# EAGLE design EncoderPCB_V2_lower (EAGLE 9.5.2)
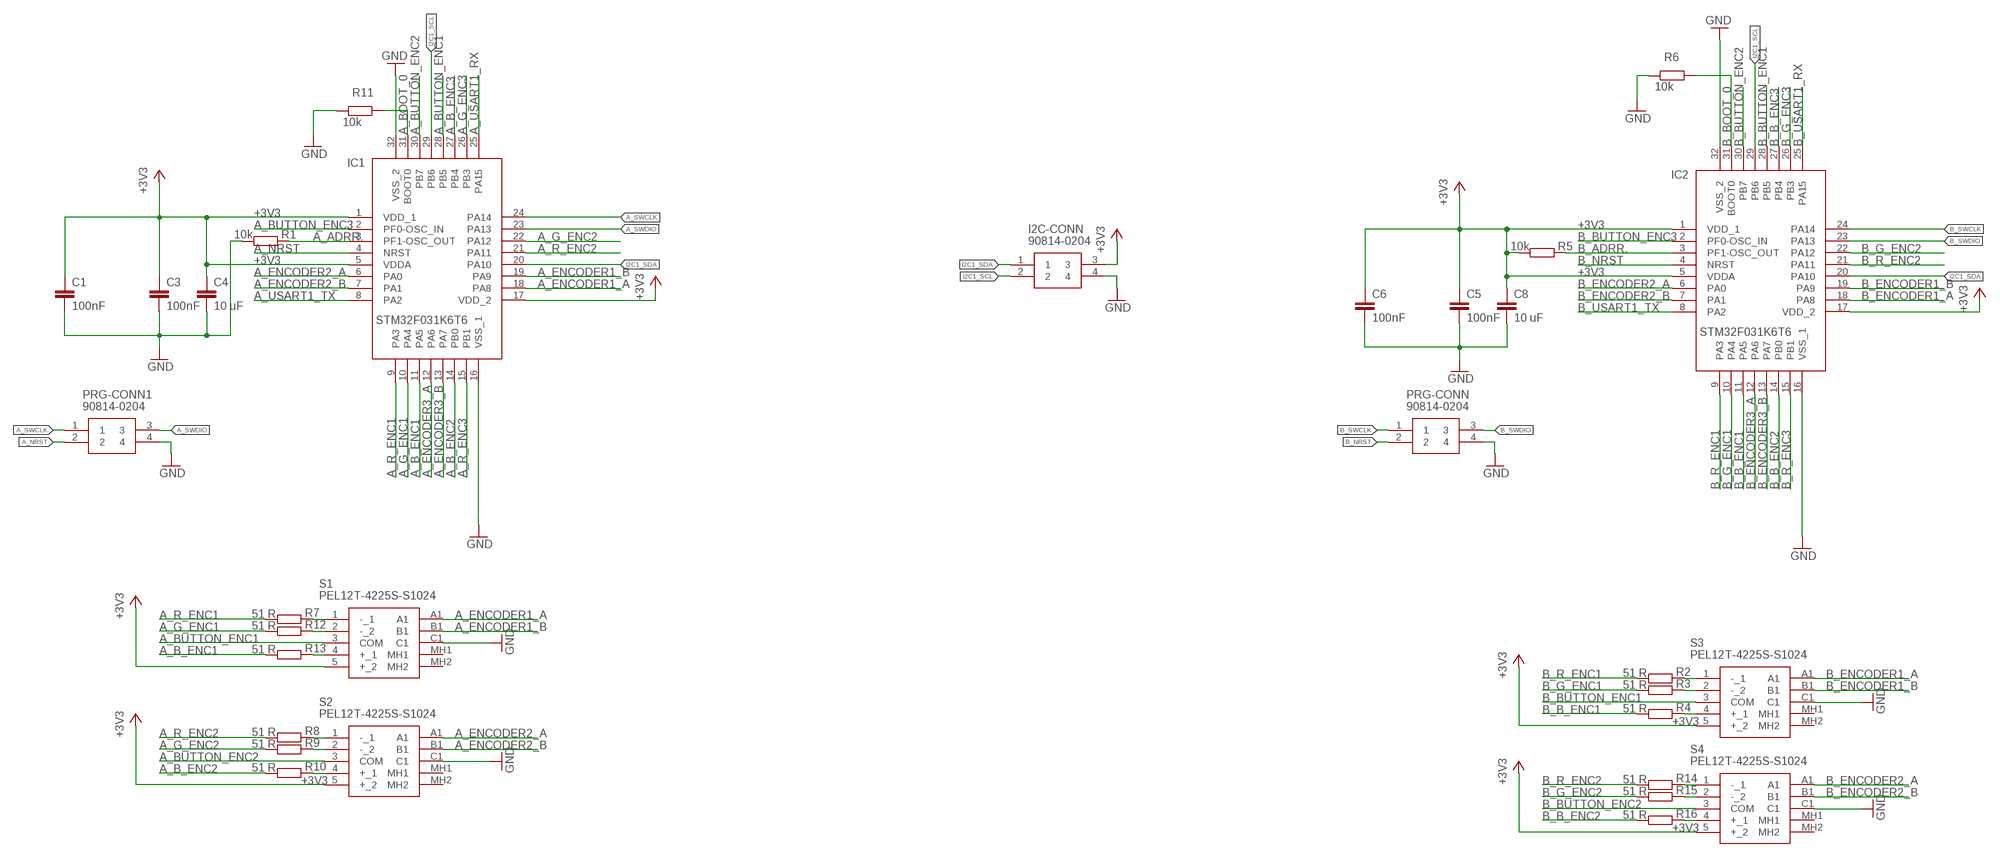
[diagram p0: schematic, sheet 1]

## Parts
C1  100nF  CAPACITOR"  [C0603]
C3  100nF  CAPACITOR"  [C0603]
C4  10 uF  CAPACITOR_1206  [C1206]
C5  100nF  CAPACITOR"  [C0603]
C6  100nF  CAPACITOR"  [C0603]
C8  10 uF  CAPACITOR_1206  [C1206]
I2C-CONN  90814-0204  [MOLEX_90814-0204]
IC1  STM32F031K6T6  [QFP80P900X900X160-32N]
IC2  STM32F031K6T6  [QFP80P900X900X160-32N]
PRG-CONN  90814-0204  [MOLEX_90814-0204]
PRG-CONN1  90814-0204  [MOLEX_90814-0204]
R1  10k  RESISTOR_0603  [R0603]
R2  51 R  RESISTOR_0603  [R0603]
R3  51 R  RESISTOR_0603  [R0603]
R4  51 R  RESISTOR_0603  [R0603]
R5  10k  RESISTOR_0603  [R0603]
R6  10k  RESISTOR_0603  [R0603]
R7  51 R  RESISTOR_0603  [R0603]
R8  51 R  RESISTOR_0603  [R0603]
R9  51 R  RESISTOR_0603  [R0603]
R10  51 R  RESISTOR_0603  [R0603]
R11  10k  RESISTOR_0603  [R0603]
R12  51 R  RESISTOR_0603  [R0603]
R13  51 R  RESISTOR_0603  [R0603]
R14  51 R  RESISTOR_0603  [R0603]
R15  51 R  RESISTOR_0603  [R0603]
R16  51 R  RESISTOR_0603  [R0603]
S1  PEL12T-4225S-S1024  [PEL12T4225SS1024]
S2  PEL12T-4225S-S1024  [PEL12T4225SS1024]
S3  PEL12T-4225S-S1024  [PEL12T4225SS1024]
S4  PEL12T-4225S-S1024  [PEL12T4225SS1024]

## Nets
+3V3: C1.1 C3.1 C4.1 C5.1 C6.1 C8.1 I2C-CONN.3 IC1.1(VDD_1) IC1.5(VDDA) IC1.17(VDD_2) IC2.1(VDD_1) IC2.5(VDDA) IC2.17(VDD_2) R5.1 S1.5(+_2) S2.5(+_2) S3.5(+_2) S4.5(+_2)
A_ADRR.: IC1.3(PF1-OSC_OUT) R1.2
A_B_ENC1: IC1.11(PA5) R13.1
A_B_ENC2: IC1.14(PB0) R10.1
A_B_ENC3: IC1.27(PB4)
A_BOOT_0: IC1.31(BOOT0) R11.2
A_BUTTON_ENC1: IC1.28(PB5) S1.3(COM)
A_BUTTON_ENC2: IC1.30(PB7) S2.3(COM)
A_BUTTON_ENC3: IC1.2(PF0-OSC_IN)
A_ENCODER1_A: IC1.18(PA8) S1.A1
A_ENCODER1_B: IC1.19(PA9) S1.B1
A_ENCODER2_A: IC1.6(PA0) S2.A1
A_ENCODER2_B: IC1.7(PA1) S2.B1
A_ENCODER3_A: IC1.12(PA6)
A_ENCODER3_B: IC1.13(PA7)
A_G_ENC1: IC1.10(PA4) R12.1
A_G_ENC2: IC1.22(PA12) R9.1
A_G_ENC3: IC1.26(PB3)
A_NRST: IC1.4(NRST) PRG-CONN1.2
A_R_ENC1: IC1.9(PA3) R7.1
A_R_ENC2: IC1.21(PA11) R8.1
A_R_ENC3: IC1.15(PB1)
A_SWCLK: IC1.24(PA14) PRG-CONN1.1
A_SWDIO: IC1.23(PA13) PRG-CONN1.3
A_USART1_RX: IC1.25(PA15)
A_USART1_TX: IC1.8(PA2)
B_ADRR.: IC2.3(PF1-OSC_OUT) R5.2
B_B_ENC1: IC2.11(PA5) R4.1
B_B_ENC2: IC2.14(PB0) R16.1
B_B_ENC3: IC2.27(PB4)
B_BOOT_0: IC2.31(BOOT0) R6.2
B_BUTTON_ENC1: IC2.28(PB5) S3.3(COM)
B_BUTTON_ENC2: IC2.30(PB7) S4.3(COM)
B_BUTTON_ENC3: IC2.2(PF0-OSC_IN)
B_ENCODER1_A: IC2.18(PA8) S3.A1
B_ENCODER1_B: IC2.19(PA9) S3.B1
B_ENCODER2_A: IC2.6(PA0) S4.A1
B_ENCODER2_B: IC2.7(PA1) S4.B1
B_ENCODER3_A: IC2.12(PA6)
B_ENCODER3_B: IC2.13(PA7)
B_G_ENC1: IC2.10(PA4) R3.1
B_G_ENC2: IC2.22(PA12) R15.1
B_G_ENC3: IC2.26(PB3)
B_NRST: IC2.4(NRST) PRG-CONN.2
B_R_ENC1: IC2.9(PA3) R2.1
B_R_ENC2: IC2.21(PA11) R14.1
B_R_ENC3: IC2.15(PB1)
B_SWCLK: IC2.24(PA14) PRG-CONN.1
B_SWDIO: IC2.23(PA13) PRG-CONN.3
B_USART1_RX: IC2.25(PA15)
B_USART1_TX: IC2.8(PA2)
GND: C1.2 C3.2 C4.2 C5.2 C6.2 C8.2 I2C-CONN.4 IC1.16(VSS_1) IC1.32(VSS_2) IC2.16(VSS_1) IC2.32(VSS_2) PRG-CONN1.4 PRG-CONN.4 R1.1 R6.1 R11.1 S1.C1 S2.C1 S3.C1 S4.C1
I2C1_SCL: I2C-CONN.2 IC1.29(PB6) IC2.29(PB6)
I2C1_SDA: I2C-CONN.1 IC1.20(PA10) IC2.20(PA10)
N$1: R7.2 S1.1(-_1)
N$2: R12.2 S1.2(-_2)
N$3: R13.2 S1.4(+_1)
N$4: R14.2 S4.1(-_1)
N$5: R15.2 S4.2(-_2)
N$6: R16.2 S4.4(+_1)
N$9: R2.2 S3.1(-_1)
N$10: R3.2 S3.2(-_2)
N$12: R4.2 S3.4(+_1)
N$15: R8.2 S2.1(-_1)
N$16: R9.2 S2.2(-_2)
N$17: R10.2 S2.4(+_1)
Unconnected: S1.MH1 S1.MH2 S2.MH1 S2.MH2 S3.MH1 S3.MH2 S4.MH1 S4.MH2

## Library data of the parts
C1 C3 C5 C6 = C_Sager_Bibliothek:CAPACITOR: capacitor
C4 C8 = passive components:CAPACITOR: ceramic capacitor
I2C-CONN PRG-CONN PRG-CONN1 = electro_mechanical:90814-0204: CONN HEADER 4POS 1.27MM SMD TIN Source: Datasheet <https://componentsearchengine.com/Datasheets/1/90814-0204.pdf>; DESCRIPTION: CONN HEADER 4POS 1.27MM SMD TIN; HEIGHT: mm; MANUFACTURER_NAME: Molex; MANUFACTURER_PART_NUMBER: 90814-0204; MOUSER_PART_NUMBER: 538-90814-0204; MOUSER_PRICE-STOCK: https://www.mouser.com/Search/Refine.aspx?Keyword=538-90814-0204
IC1 IC2 = C_Sager_Bibliothek:STM32F031K6T6: ARM Microcontrollers - MCU 16/32-BITS MICROS Source: Datasheet <https://componentsearchengine.com/Datasheets/1/STM32F031K6T6.pdf>; DESCRIPTION: ARM Microcontrollers - MCU 16/32-BITS MICROS; HEIGHT: 1.6mm; MANUFACTURER_NAME: STMicroelectronics; MANUFACTURER_PART_NUMBER: STM32F031K6T6; MOUSER_PART_NUMBER: 511-STM32F031K6T6; MOUSER_PRICE-STOCK: https://www.mouser.com/Search/Refine.aspx?Keyword=511-STM32F031K6T6
R1-R16 = passive components:RESISTOR: +/- 5 % resistor
S1-S4 = electro_mechanical:PEL12T-4225S-S1024: Encoders Red Blue/Green LED Push Switch Knurled Source: Datasheet <https://componentsearchengine.com/Datasheets/1/PEL12T-4225S-S1024.pdf>; DESCRIPTION: Encoders Red Blue/Green LED Push Switch Knurled; HEIGHT: 25mm; MANUFACTURER_NAME: Bourns; MANUFACTURER_PART_NUMBER: PEL12T-4225S-S1024; MOUSER_PART_NUMBER: 652-PEL12T4225SS1024; MOUSER_PRICE-STOCK: https://www.mouser.com/Search/Refine.aspx?Keyword=652-PEL12T4225SS1024

## Board
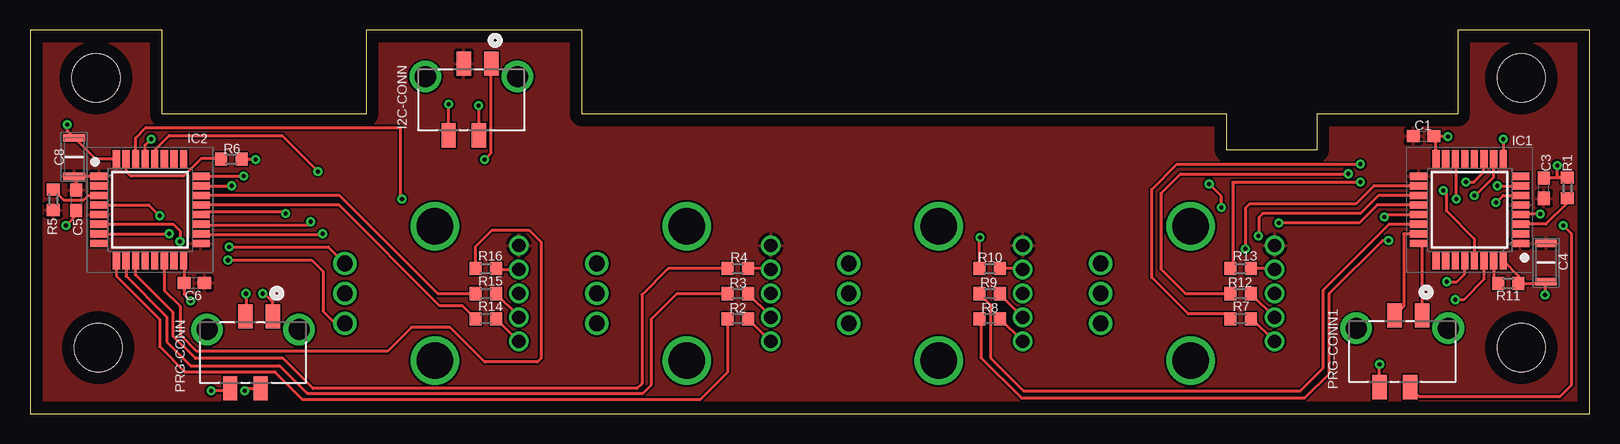
[diagram p1: board, top side]
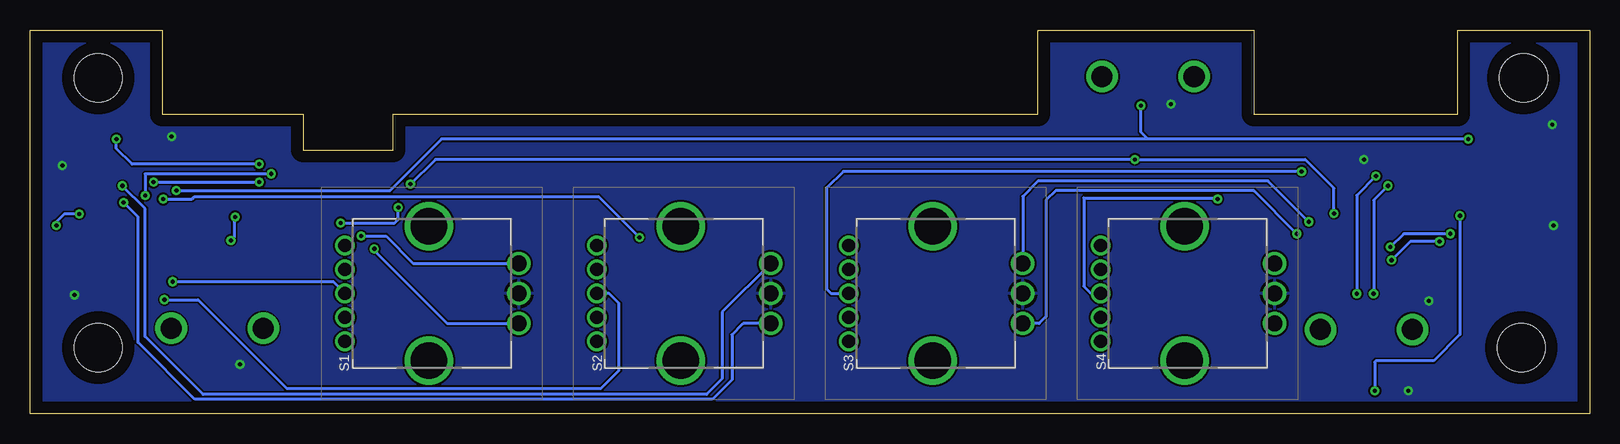
[diagram p2: board, bottom side, seen from below]

Size 130 x 32 mm. Coordinates in mm from the lower left corner, seen from the top.
Outline: 0,0 130,0 130,32 119,32 119,25 107.25,25 107.25,22 99.75,22 99.75,25 46,25 46,32 28,32 28,25 11,25 11,32 0,32 0,0
Copper layers (1*16): Top 0.035mm / dielectric 1.5mm / Bottom 0.035mm
Design rules "2layer": minimum track width 6mil, minimum drill 0.35mm, track to track 6mil, track to pad 6mil, pad to pad 6mil, via to via 6mil, smd to smd 6mil, copper to edge 40mil, drill to drill 6mil, minimum pad ring 10mil, minimum via ring 8mil, stop-mask expansion 4mil, vias tented up to drill 0mil, thermal gap 10mil
Holes 4 mm at 124.31,5.5 5.69,5.5 5.5,28 124.31,28

### Footprints (pad centres in the part's own frame; a part is rotated, then mirrored left to right if it is on the bottom)
C0603 = smd 1.1 x 1: 1 -0.85,0; 2 0.85,0
C1206 = smd 0.62 x 1.82: 1 -1.6,0; 2 1.6,0
MOLEX_90814-0204 = smd 1.194 x 2.007: 1 0.254,0; 2 1.27,5.994; 3 2.54,0; 4 3.81,5.994 | drill 1.753 pad 2.629: 5 -1.93,1.092; 6 5.74,1.092
QFP80P900X900X160-32N = smd 1.475 x 0.6: 1 -4.238,2.8; 2 -4.238,2; 3 -4.238,1.2; 4 -4.238,0.4; 5 -4.238,-0.4; 6 -4.238,-1.2; 7 -4.238,-2; 8 -4.238,-2.8; 17 4.238,-2.8; 18 4.238,-2; 19 4.238,-1.2; 20 4.238,-0.4; 21 4.238,0.4; 22 4.238,1.2; 23 4.238,2; 24 4.238,2.8 | smd 0.6 x 1.475: 9 -2.8,-4.238; 10 -2,-4.238; 11 -1.2,-4.238; 12 -0.4,-4.238; 13 0.4,-4.238; 14 1.2,-4.238; 15 2,-4.238; 16 2.8,-4.238; 25 2.8,4.238; 26 2,4.238; 27 1.2,4.238; 28 0.4,4.238; 29 -0.4,4.238; 30 -1.2,4.238; 31 -2,4.238; 32 -2.8,4.238
R0603 = smd 1 x 1.1: 1 -0.85,0; 2 0.85,0
PEL12T4225SS1024 = drill 1.1 pad 1.6: 1 -4,7.25; 2 -2,7.25; 3 0,7.25; 4 2,7.25; 5 4,7.25 | drill 1.3 pad 1.85: A1 -2.5,-7.25; B1 2.5,-7.25; C1 0,-7.25 | drill 3.041 pad 3.175: MH1 -5.6,0.25; MH2 5.6,0.25

### Placement (x,y rotation side)
C1  116.17,23.14 0 top
C3  126.19,18.8 90 top
C4  126.38,12.59 270 top
C5  3.85,17.8 270 top
C6  13.7,10.88 180 top
C8  3.68,21.41 90 top
I2C-CONN  38.7,29.2 180 top
IC1  120,17 180 top
IC2  10,17 0 top
PRG-CONN  20.5,8.1 180 top
PRG-CONN1  116.3,8.2 180 top
R1  128.15,18.83 270 top
R2  59,7.9 0 top
R3  59,10 0 top
R4  59,12.1 0 top
R5  1.94,17.84 90 top
R6  16.78,21.22 180 top
R7  100.9,7.9 0 top
R8  80,7.9 0 top
R9  80,10 0 top
R10  80,12.1 0 top
R11  123.23,10.85 180 top
R12  100.9,10 0 top
R13  100.9,12.1 0 top
R14  38,7.9 0 top
R15  38,10 0 top
R16  38,12.1 0 top
S1  96.5,10.02 90 bottom
S2  75.5,10.02 90 bottom
S3  54.5,10.02 90 bottom
S4  33.5,10.02 90 bottom

### Tracks (layer width: path | path; a pad name or v marks a point on that pad's centre or on a via)
+3V3
  Top 0.254: C5.1 3.85,19.64 C8.1 IC2.1
  pour Top: 130,32 130,0 0,0 0,32 10.9,32 10.9,25 28,25 28,32 46,32 46,25 99.7,25 99.7,22 107.3,22 107.3,25 119,25 119,32
A_ADRR.
  Top 0.254: R1.2 128.15,17.58 126.37,15.8 IC1.3
A_B_ENC1  (via drill 0.35)
  Top 0.254: R13.1 100.25,12.3 100.25,19.3 v110.9,19.3 | v119.7,19.3 120.36,19.3 121.2,20.14 IC1.11
  Bottom 0.254: v119.7,19.3 v110.9,19.3
A_B_ENC2  (via drill 0.35)
  Top 0.254: R10.1 79.15,14.65 v79.2,14.7 | v118.9,17.9 118.9,21.14 IC1.14
  Bottom 0.254: v118.9,17.9 116.5,17.9 116.3,18.1 82.6,18.1 v79.2,14.7
A_BOOT_0
  Top 0.254: IC1.31 122,11.23 R11.2
A_BUTTON_ENC1  (via drill 0.35)
  Top 0.254: v118.1,11 118.94,11 119.6,11.66 IC1.28
  Bottom 0.254: S1.3 103.75,10.05 104.7,11 v118.1,11
A_BUTTON_ENC2  (via drill 0.35)
  Top 0.254: IC1.30 121.2,11.2 119.5,9.5 v118.8,9.5
  Bottom 0.254: v118.8,9.5 116,9.5 108.61,2.11 82.39,2.11 80.9,3.6 80.9,9.2 81.72,10.02 S2.3
A_ENCODER1_A  (via drill 0.35)
  Top 0.254: IC1.18 115.74,18.98 112.01,18.98 110.53,17.5 101.66,17.5 101.3,17.14 v101.3,13.74
  Bottom 0.254: v101.3,13.74 101.26,13.74 101.26,13.56 95.21,7.52 S1.A1
A_ENCODER1_B  (via drill 0.35)
  Top 0.254: IC1.19 112.4,18.2 110.9,16.7 102.77,16.7 102.44,16.37 102.44,14.84 v102.4,14.8
  Bottom 0.254: v102.4,14.8 100.33,14.8 98.05,12.52 S1.B1
A_ENCODER2_A  (via drill 0.35)
  Top 0.254: v122.2,17.6 122.8,18.2 IC1.6
  Bottom 0.254: S2.A1 70.55,7.52 71.5,6.57 71.5,2.8 73.11,1.19 116.26,1.19 121,5.93 121,16.4 v122.2,17.6
A_ENCODER2_B  (via drill 0.35)
  Top 0.254: v122.3,19 IC1.7
  Bottom 0.254: S2.B1 72.3,8.47 72.3,2.9 73.6,1.6 115.56,1.6 120.4,6.43 120.4,17.1 v122.3,19
A_G_ENC1  (via drill 0.35)
  Top 0.254: R12.1 96.35,10 94.27,12.08 94.27,18.37 95.9,20 v109.9,20 | IC1.10 122,19.74 120.46,18.2 v120.4,18.2
  Bottom 0.254: v109.9,20 120.4,20 v120.4,18.2
A_G_ENC2
  Top 0.254: R9.1 80.07,9.08 80.07,4.63 82.81,1.9 105.9,1.9 107.8,3.8 107.8,10.3 113.3,15.8 IC1.22
A_NRST  (via drill 0.35)
  Top 0.254: PRG-CONN1.2 115.83,1.41 127.51,1.41 128.5,2.4 128.5,15 v127.8,15.7 | v125.89,16.66 124.3,16.66 IC1.4
  Bottom 0.254: v127.8,15.7 127.8,16 127.14,16.66 v125.89,16.66
A_R_ENC1  (via drill 0.35)
  Top 0.254: R7.1 99.65,8.3 96.55,8.3 93.5,11.35 93.5,18.7 95.56,20.76 110.86,20.76 v110.9,20.8 | v122.8,22.9 IC1.9
  Bottom 0.254: v110.9,20.8 121.5,20.8 122.8,22.1 v122.8,22.9
A_R_ENC2  (via drill 0.35)
  Top 0.254: v113.25,14.45 112.75,14.45 108.31,10.01 108.31,3.33 106.27,1.29 82.64,1.29 79.26,4.67 79.26,7.79 R8.1 | v112.9,16.4 113.1,16.6 IC1.21
  Bottom 0.254: v113.25,14.45 113,14.7 113,16.4 v112.9,16.4
A_SWCLK
  Top 0.254: PRG-CONN1.1 116.05,13.92 IC1.24
A_SWDIO
  Top 0.254: IC1.23 114.5,15 114.5,8.94 PRG-CONN1.3
B_ADRR.
  Top 0.254: IC2.3 4.85,18.2 4.47,17.82 2.81,17.82 R5.2
B_B_ENC1
  Top 0.254: R4.1 53.2,12.1 51,9.9 51,2.5 50.6,2.1 23.6,2.1 21.1,4.6 13.8,4.6 11.9,6.5 11.9,8.46 8.8,11.56 IC2.11
B_B_ENC2
  Top 0.254: R16.1 37.15,13.95 38.5,15.3 41.6,15.3 42.6,14.3 42.6,4.6 42.3,4.3 37.9,4.3 35,7.2 31.8,7.2 29.8,5.2 13.9,5.2 12.5,6.6 12.5,8.96 11.2,10.26 IC2.14
B_BOOT_0
  Top 0.254: IC2.31 8.02,21.22 8.02,20.18 8.4,19.8 12.8,19.8 14.29,21.28 15.87,21.28 R6.2
B_BUTTON_ENC1  (via drill 0.35)
  Top 0.254: IC2.28 10.4,22 11.6,23.2 21,23.2 v24,20.2
  Bottom 0.254: S3.3 63.22,10.02 63.6,10.4 63.6,18.8 62.2,20.2 v24,20.2
B_BUTTON_ENC2  (via drill 0.35)
  Top 0.254: IC2.30 8.8,23 9.66,23.86 30.9,23.86 30.9,18 v31,17.9
  Bottom 0.254: S4.3 41.55,10.02 42.15,10.62 42.15,18 31.1,18 v31,17.9
B_ENCODER1_A  (via drill 0.35)
  Top 0.254: v24.4,15 24.3,14.9 14.34,14.9 IC2.18
  Bottom 0.254: v24.4,15 28,18.6 44.5,18.6 45.3,17.8 45.3,8.1 45.88,7.52 S3.A1
B_ENCODER1_B  (via drill 0.35)
  Top 0.254: IC2.19 14.34,15.7 23.1,15.7 v23.4,16
  Bottom 0.254: v23.4,16 26.8,19.4 45.97,19.4 47.25,18.12 S3.B1
B_ENCODER2_A  (via drill 0.35)
  Top 0.254: IC2.6 11.94,15.8 12.5,15.24 v12.5,14.34 | v16.5,12.8 23.47,12.8 24.43,11.84 24.43,8.54 25.45,7.52 S4.A1
  Bottom 0.254: v12.5,14.34 14.96,14.34 v16.5,12.8
B_ENCODER2_B  (via drill 0.35)
  Top 0.254: IC2.7 v11.6,15 | v16.6,13.9 24.87,13.9 S4.B1
  Bottom 0.254: v11.6,15 15.5,15 v16.6,13.9
B_G_ENC1
  Top 0.254: R3.1 53.9,10 51.8,7.9 51.8,2.4 51.09,1.69 23.11,1.69 20.8,4 13.4,4 11.4,6 11.4,8.06 8,11.46 IC2.10
B_G_ENC2
  Top 0.254: R15.1 34.01,10 25.81,18.2 IC2.22
B_NRST  (via drill 0.35)
  Top 0.254: IC2.4 9.9,17.4 v10.8,16.5 | v17.9,1.9 18.11,2.11 PRG-CONN.2
  Bottom 0.254: v10.8,16.5 10.8,6.6 13,4.4 17.8,4.4 17.9,4.3 v17.9,1.9
B_R_ENC1
  Top 0.254: R2.1 58.15,3.45 55.9,1.2 22.7,1.2 20.4,3.5 12.9,3.5 10.8,5.6 10.8,7.86 7.2,11.46 IC2.9
B_R_ENC2
  Top 0.254: R14.1 36.05,9 34.15,9 25.75,17.4 IC2.21
B_SWCLK  (via drill 0.35)
  Top 0.254: IC2.24 v17.8,19.8 | v19.4,10 19.55,10 20.25,9.3 PRG-CONN.1
  Bottom 0.254: v17.8,19.8 19.4,18.2 v19.4,10
B_SWDIO  (via drill 0.35)
  Top 0.254: IC2.23 v16.8,19 | v18,10 18,8.14 PRG-CONN.3
  Bottom 0.254: v16.8,19 18,17.8 v18,10
GND  (via drill 0.35)
  Top 0.254: C5.2 3.85,16.55 v3,15.7 | 7.22,21.22 IC2.32 5.48,21.24 5.47,21.22 C8.2 3.1,23.59 v3.1,24.1 | IC2.16 12.85,12.71 C6.2 12.85,9.95 v13.4,9.4 | PRG-CONN.4 16.48,1.9 v15.1,1.9 | I2C-CONN.4 v34.89,25.79 v34.9,25.8 | IC1.16 117.2,22.96 C1.2 118.16,23.14 v118.2,23.1 | C4.2 126.29,10.9 v126.29,9.9 126.29,10.85 R11.1 124.08,11.48 IC1.32 | C3.2 126.23,19.68 R1.1 127.32,19.68 127.3,19.7 v127.3,20.7 | PRG-CONN1.4 v112.49,4.09 v112.5,4.1 | R6.1 18.78,21.22 v18.8,21.2
  pour Bottom: 130,32 130,0 -0.5,0 -0.5,32 10.9,32 10.9,25 28,25 28,32 46,32 46,25 99.7,25 99.7,22 107.3,22 107.3,25 119,25 119,32
I2C1_SCL  (via drill 0.35)
  Top 0.254: IC2.29 9.6,22.4 v10.1,22.9 | I2C-CONN.2 37.43,25.67 v37.4,25.7 | v117.8,18.6 118.04,18.36 118.04,16.93 120.4,14.57 IC1.29
  Bottom 0.254: v10.1,22.9 36.8,22.9 | 36.8,22.9 37.4,23.5 v37.4,25.7 | 36.8,22.9 95.7,22.9 100,18.6 v117.8,18.6
I2C1_SDA  (via drill 0.35)
  Top 0.254: v21.3,16.7 21.2,16.8 14.44,16.8 IC2.20 | v37.9,21.2 38.45,21.75 I2C-CONN.1 | IC1.20 112.3,17.4 110.8,15.9 v104.1,15.9 | v99.3,17.2 99.3,18.14 v98.29,19.15
  Bottom 0.254: v21.3,16.7 21.3,18.8 23.7,21.2 v37.9,21.2 96.2,21.2 98.29,19.11 v98.29,19.15 | v104.1,15.9 99.6,15.9 99.3,16.2 v99.3,17.2
N$1
  Top 0.254: S1.1 101.87,7.9 R7.2
N$2
  Top 0.254: R12.2 101.77,10 S1.2
N$3
  Top 0.254: S1.4 103.67,12.1 R13.2
N$4
  Top 0.254: R14.2 40.73,6.02 S4.1
N$5
  Top 0.254: S4.2 40.75,8.1 R15.2
N$6
  Top 0.254: R16.2 38.93,12.02 S4.4
N$9
  Top 0.254: S3.1 61.73,6.02 R2.2
N$10
  Top 0.254: S3.2 61.75,8.1 R3.2
N$12
  Top 0.254: S3.4 61.67,12.1 R4.2
N$15
  Top 0.254: S2.1 80.87,7.9 R8.2
N$16
  Top 0.254: R9.2 80.85,9.92 S2.2
N$17
  Top 0.254: S2.4 82.67,12.1 R10.2